# Altium schematic sheet Sheet1.SchDoc
size A; SheetNumber: 1; SheetTotal: 1
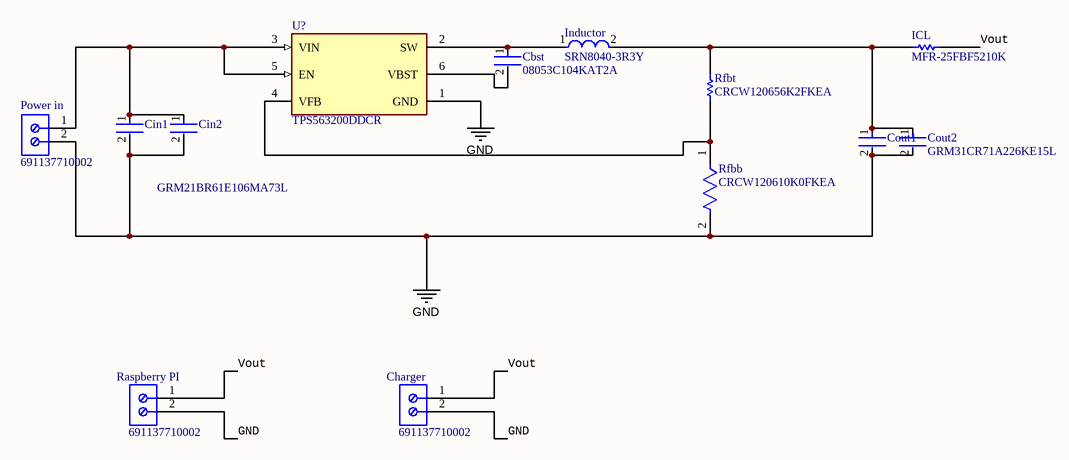
[diagram p0: Sheet1.SchDoc]

## Parts
Cbst  08053C104KAT2A  [FP-0805-L_2_01_0_2-W_1_25-IPC_C]
Charger  691137710002  [691137710002]
Cin1  GRM21BR61E106MA73L  [FP-GRM21B-0_15-IPC_A]  (value not drawn)
Cin2  GRM21BR61E106MA73L  [FP-GRM21B-0_15-IPC_A]
Cout1  GRM31CR71A226KE15L  [FP-GRM31C-0_2-e0_3_0_8-MFG]  (value not drawn)
Cout2  GRM31CR71A226KE15L  [FP-GRM31C-0_2-e0_3_0_8-MFG]
ICL  MFR-25FBF5210K  [RESA60-630X240]
Inductor  SRN8040-3R3Y  [FP-SRN8040-MFG]
Power_in  691137710002  [691137710002]
Raspberry_PI  691137710002  [691137710002]
Rfbb  CRCW120610K0FKEA  [FP-CRCW1206-e3-IPC_C]
Rfbt  CRCW120656K2FKEA  [RESC3216X60X45ML10T20]
U?  TPS563200DDCR  [FP-DDC0006A-MFG]

## Nets
GND: Charger.2 Cin1.2 Cin2.2 Cout1.2 Cout2.2 Power_in.2 Raspberry_PI.2 Rfbb.2 U?.1(GND)
Vout: Charger.1 ICL.1 Raspberry_PI.1
NetCbst_1: Cbst.1 Inductor.1 U?.2(SW)
NetCbst_2: Cbst.2 U?.6(VBST)
NetCin1_1: Cin1.1 Cin2.1 Power_in.1 U?.3(VIN) U?.5(EN)
NetCout1_1: Cout1.1 Cout2.1 ICL.2 Inductor.2 Rfbt.1
NetRfbb_1: Rfbb.1 Rfbt.2 U?.4(VFB)

## Library data of the parts
Cbst = CMP-2000-05014-2: General Purpose Ceramic Capacitor, 0805, 100nF, 10%, X7R, 0.15, 25V; Dissipation Factor: 3%; Insulation Resistance: 100GR; Tolerance: 10%; Height: 0.94mm; Case/Package: 0805; Case Code (Imperial): 0805; Number of Pins: 2; Termination: SMD/SMT; Case Code (Metric): 2012; Depth: 1.25mm; Min Operating Temperature: -55°C; Radiation Hardening: No; Max Operating Temperature: 125°C; Length: 2.01mm; Thickness: 0.037inch; Series: -; Dielectric: X7R; Voltage Rating (DC): 25V; Packaging: Tape and Reel; Width: 0.049inch; Capacitance: 100nF; Construction: Flat; Voltage: 25V; RoHS Compliant: Yes; REACH SVHC: No SVHC; Package Quantity: 1; Voltage Rating: 25V; Mount: Surface Mount; Lead Free: Lead Free; Contact Plating: Tin
Charger Power_in Raspberry_PI = CMP-1502-03324-2: NexarPartId: 78871135; Voltage Rating: 300V; Number of Contacts: 2; Current Rating: 16A; Lead Pitch: 5mm; Height: 11.6mm; Packaging: Box; RoHS: Non-Compliant; Contact Material: Nickel, Tin; Max Operating Temperature: 120°C; Number of Pins: 2; Min Operating Temperature: -30°C; Number of Rows: 1
Cin1 Cin2 = CMP-06035-013048-1: Chip Multilayer Ceramic Capacitors for General Purpose, 0805, 10uF, X5R, 15%, 20%, 25V; Max Operating Temperature: 85°C; Package Quantity: 3000; Case/Package: 0805; Depth: 1.25mm; Case Code (Imperial): 0805; Termination: SMD/SMT; Width: 0.049inch; Packaging: Tape and Reel; Tolerance: 20%; Height: 1.25mm; Min Operating Temperature: -55°C; Capacitance: 10uF; Weight: 0.000335oz; Voltage Rating (DC): 25V; Dielectric: X5R; Length: 2mm; Thickness: 0.055inch; Voltage Rating: 25V; Resistor Type: Ceramic; Lead Free: Lead Free; Case Code (Metric): 2012; Mount: Surface Mount; REACH SVHC: No SVHC
Cout1 Cout2 = CMP-06035-003841-1: Chip Multilayer Ceramic Capacitors for General Purpose, 1206, 22uF, X7R, 15%, 10%, 10V; Height: 1.6mm; Width: 0.063inch; Min Operating Temperature: -55°C; Package Quantity: 1; Termination: SMD/SMT; Length: 3.2mm; Voltage Rating: 10V; Case/Package: 1206; Capacitance: 22uF; Case Code (Imperial): 1206; Depth: 1.6mm; Dielectric: X7R; Voltage: 10V; Material: Ceramic; Tolerance: 10%; Voltage Rating (DC): 10V; Lead Free: Lead Free; Max Operating Temperature: 125°C; Case Code (Metric): 3216; Packaging: Tape and Reel; Thickness: 0.071inch; Radiation Hardening: No; REACH SVHC: No SVHC; Mount: Surface Mount
ICL = CMP-1659-00074-2: Axial Resistor, 10 KOhm, +/- 1%, 0.25 W, -55 to 155 degC, 2-Pin THD, RoHS, Bulk; Manufacturer: Yageo; Temperature Coefficient: 100ppm\/degreesC; Voltage Rating: 250V; Voltage Rating (DC): 200V; Resistance: 10KOhm; Max Power Dissipation: 250mW; Datasheet URL: http://www.yageo.com/documents/recent/Yageo%20LR_MFR_2013.pdf; Packaging: Bulk; RoHSCompliant: True; Mount: ThroughHole; Package Reference: MFR-25; Termination: Axial; Composition: MetalFilm; Number of Terminations: 2; Package Quantity: 200; Mounting Technology: ThroughHole; Length: 0.248inch; Max Operating Temperature: 155degC; Min Operating Temperature: -55degC; Datasheet Version: 04/2013; Lead Free: LeadFree; Manufacturer URL: http://www.yageo.com/; Tolerance: 1%; Power Rating: 250mW; Package Description: 2-Pin Axial Lead, Dia 2.4 mm, Body Length 6.3 mm; Military Standard: Not; Case\/Package: Axial
Inductor = CMP-07248-000074-1: FIXED IND 3.3UH 5.6A 21 MOHM SMD; Tolerance: 30%; Shielding: Shielded; DC Resistance (DCR): 21mR; Self Resonant Frequency: 34MHz; Saturation Current: 5.5A; Sample Rate (Hz): 100kHz; Core Material: Ferrite; Depth: 8.3mm; Inductance: 3.3uH; Current Rating: 5.6A; DC Current: 5.6A; Max Operating Temperature: 125°C; REACH SVHC: No SVHC; Package Quantity: 1000; Resistor Type: Wirewound; RoHS Compliant: Yes; Width: 8mm; Case/Package: Nonstandard; Height: 4mm; Min Operating Temperature: -40°C; Number of Pins: 2; Series: SRN8040; RMS Current (Irms): 5.6A; Mount: Surface Mount; Military Standard: Not; Material: Steel; Max DC Current: 5.6A; Termination: SMD/SMT; Packaging: Tape and Reel; Test Frequency: 100kHz; Height - Seated (Max): 0.157inch; Length: 8mm; Inductance Tolerance: 30%
Rfbb = CMP-2003-04807-2: RES Thick Film, 10kΩ, 1%, 0.25W, 100ppm/°C, 1206; Working Voltage: 200V; Max Power Dissipation: 250mW; Resistance: 10kR; Tolerance: 1%; Width: 0.063inch; Height: 0.55mm; Number of Pins: 2; Voltage Rating: 200V; Temperature Coefficient: 100ppm/°C; Military Standard: Not; Features: Automotive AEC-Q200; Depth: 1.6mm; Radiation Hardening: No; Termination: SMD/SMT; Case Code (Imperial): 1206; Weight: 0.000353oz; Length: 3.2mm; Package Quantity: 10; Voltage Rating (DC): 200V; Case/Package: 1206; Min Operating Temperature: -55°C; Number of Terminations: 2; Composition: Thick Film; Contact Plating: Tin; Power Rating: 250mW; Packaging: Tape and Reel; Max Operating Temperature: 155°C; Lead Free: Lead Free; Case Code (Metric): 3216
Rfbt = CMP-2003-02284-1: Manufacturer: Vishay Dale; Part Number: CRCW120656K2FKEA
U? = CMP-04918-000155-1: IC REG BUCK ADJ 3A TSOT23-6; Quiescent Current: 190uA; Output Voltage: 7V; Min Input Voltage: 4.5V; Output Configuration: Positive; Number of Outputs: 1; Switching Frequency: 650kHz; Synchronous Rectifier: Yes; Min Output Voltage: 760mV; Output Type: Adjustable; Operating Supply Voltage: 17V; Max Operating Temperature: 125°C; Lead Free: Lead Free; Packaging: Tape and Reel; Radiation Hardening: No; Mount: Surface Mount; Contact Plating: Tin; Output Current: 3A; Max Output Voltage: 7V; Min Operating Temperature: -40°C; Case/Package: SOT-23-6; Max Output Current: 3A; Max Input Voltage: 17V